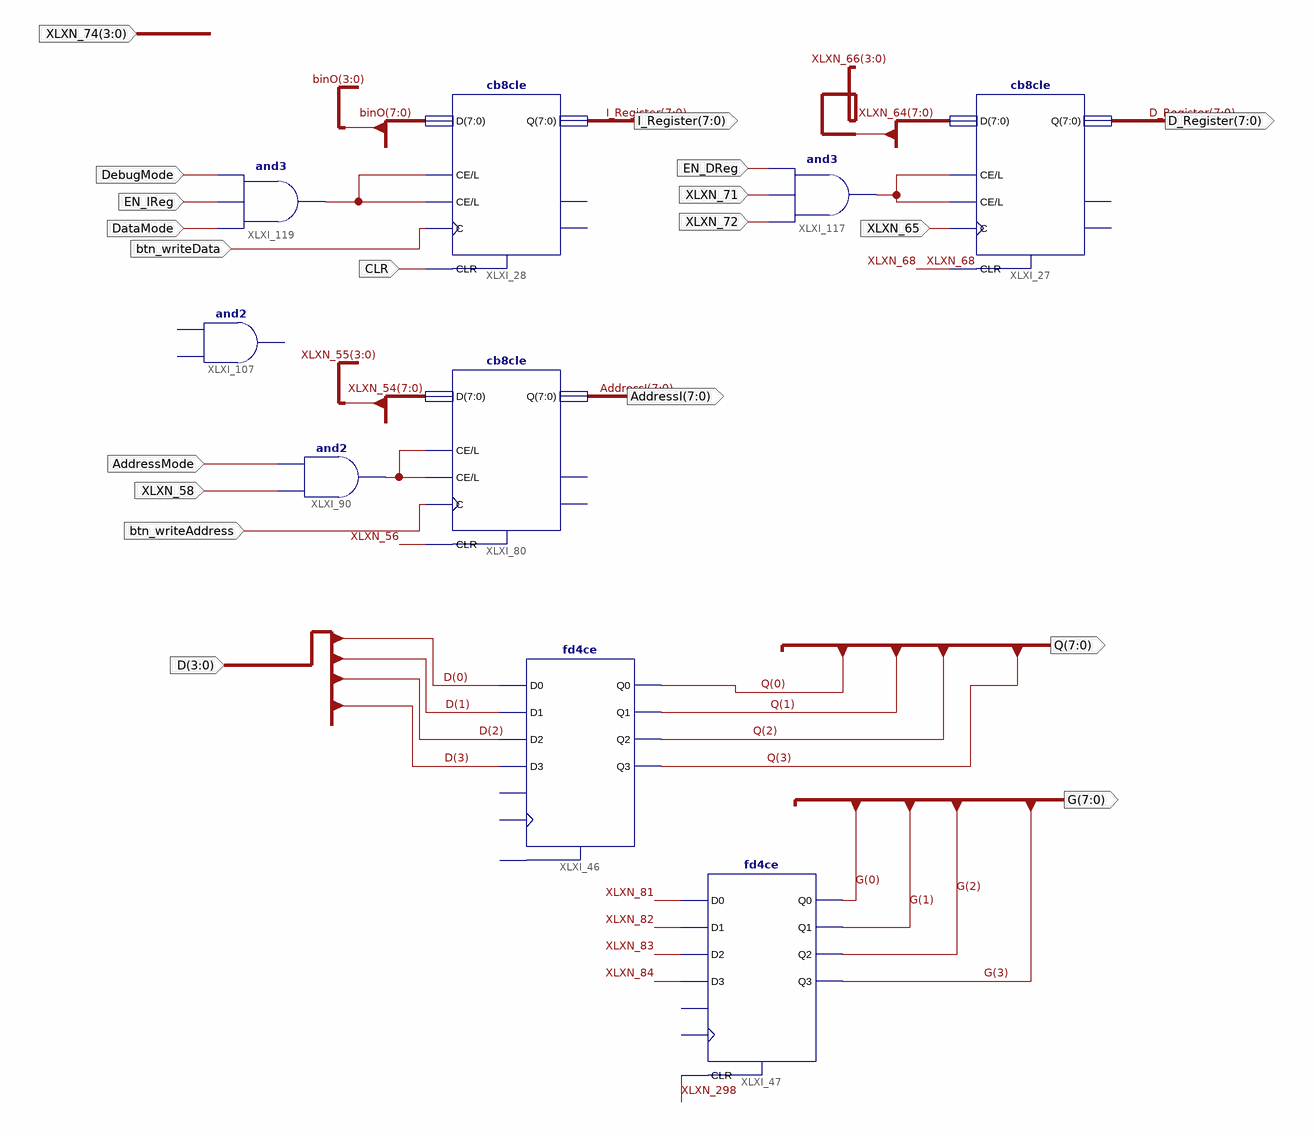
[diagram p0: schematic sheet 1]
// Xilinx ISE schematic Registers_old.sch (spartan3e) as structural Verilog: 9 symbols, 19 ports
module Registers_old (
  input  btn_writeData,
  input  CLR,
  input  DataMode,
  input  EN_IReg,
  input  DebugMode,
  input  AddressMode,
  input  XLXN_58,
  input  btn_writeAddress,
  input  XLXN_65,
  input  EN_DReg,
  input  XLXN_71,
  input  XLXN_72,
  input  [3:0] XLXN_74,
  input  [3:0] D,
  output [7:0] I_Register,
  output [7:0] AddressI,
  output [7:0] D_Register,
  output [7:0] Q,
  output [7:0] G
);

  wire XLXN_56, XLXN_68, XLXN_81, XLXN_82, XLXN_83, XLXN_84, XLXN_240, XLXN_248, XLXN_283, XLXN_298;
  wire [7:0] binO, XLXN_54, XLXN_64;

  and XLXI_119 (XLXN_248, DataMode, EN_IReg, DebugMode);
  cb8cle XLXI_28 (
    .C(btn_writeData), .CE(XLXN_248), .CLR(CLR), .D(binO), .L(XLXN_248), .Q(I_Register));  // open: CEO, TC
  cb8cle XLXI_80 (
    .C(btn_writeAddress), .CE(XLXN_240), .CLR(XLXN_56), .D(XLXN_54), .L(XLXN_240), .Q(AddressI));  // open: CEO, TC
  and XLXI_90 (XLXN_240, XLXN_58, AddressMode);
  // and2 XLXI_107 is placed but not wired
  cb8cle XLXI_27 (
    .C(XLXN_65), .CE(XLXN_283), .CLR(XLXN_68), .D(XLXN_64), .L(XLXN_283), .Q(D_Register));  // open: CEO, TC
  and XLXI_117 (XLXN_283, XLXN_72, XLXN_71, EN_DReg);
  fd4ce XLXI_46 (
    .D0(D[0]), .D1(D[1]), .D2(D[2]), .D3(D[3]), .Q0(Q[0]), .Q1(Q[1]), .Q2(Q[2]), .Q3(Q[3]));  // open: C, CE, CLR
  fd4ce XLXI_47 (
    .CLR(XLXN_298), .D0(XLXN_81), .D1(XLXN_82), .D2(XLXN_83), .D3(XLXN_84), .Q0(G[0]), .Q1(G[1]), .Q2(G[2]),
    .Q3(G[3]));  // open: C, CE
endmodule
